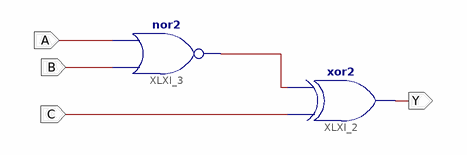
[diagram p0: schematic sheet 1]
// Xilinx ISE schematic MINORITY.sch (spartan6) as structural Verilog: 2 symbols, 4 ports
module MINORITY (
  input  A,
  input  B,
  input  C,
  output Y
);

  wire XLXN_3;

  xor XLXI_2 (Y, C, XLXN_3);
  nor XLXI_3 (XLXN_3, B, A);
endmodule
